# Altium schematic sheet SBUS&JTAG.SchDoc
size A4
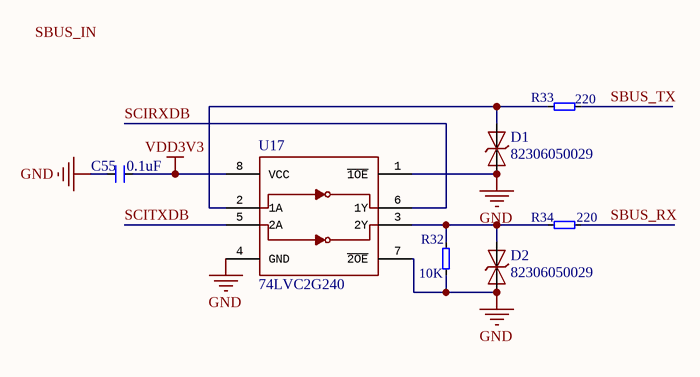
[diagram p0: SBUS&JTAG.SchDoc]

## Parts
C55  0.1uF  [0603C]
D1  82306050029  [0603R]
D2  82306050029  [0603R]
R32  10K  [0603R]
R33  220  [0603R]
R34  220  [0603R]
U17  74LVC2G240  [VSSOP8-0.5]

## Nets
GND: C55.2 D1.2 D2.2 R32.2 U17.1(~{1OE}) U17.4(GND) U17.7(~{2OE})
VDD3V3: C55.1 U17.8(VCC)
SBUS_RX: R34.1
SBUS_TX: R33.1
SCIRXDB: U17.6(1Y)
SCITXDB: U17.5(2A)
NetD1_1: D1.1 R33.2 U17.2(1A)
NetD2_1: D2.1 R32.1 R34.2 U17.3(2Y)

## Notes on the sheet
- Labels drawn without touching a wire or pin: SBUS_IN

## Library data of the parts
C55 = C
D1 D2 = DIODE-TVS/Bidirectional
R32-R34 = R